# EAGLE design clock (EAGLE 9.5.2)
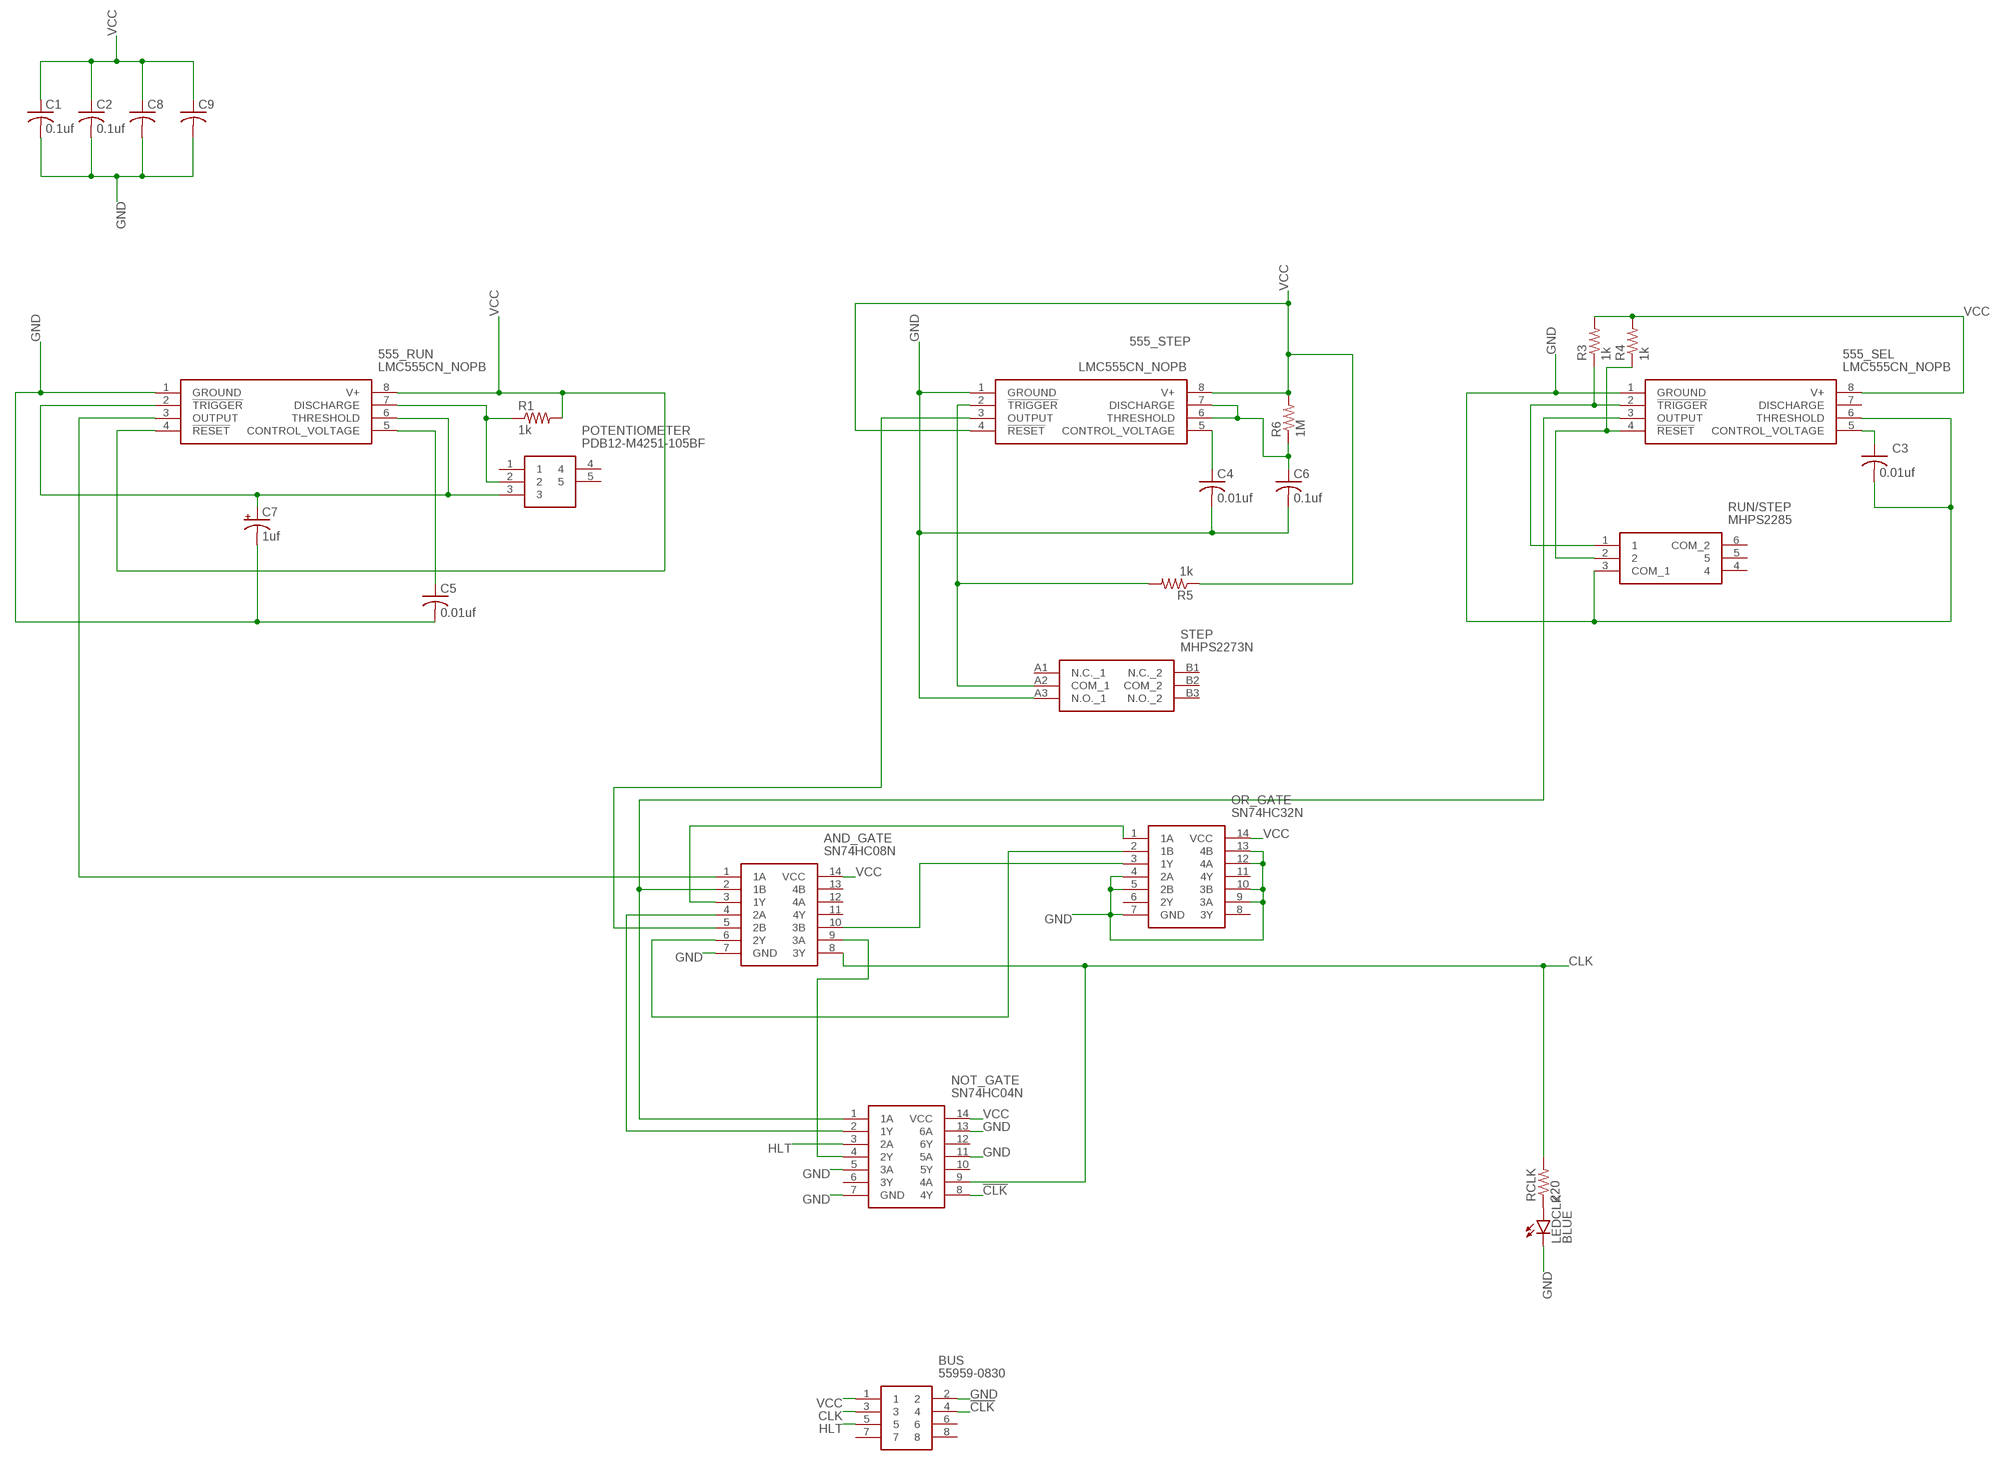
[diagram p0: schematic, sheet 1]

## Parts
555_RUN  LMC555CN_NOPB  [DIP794W53P254L959H508Q8N]
555_SEL  LMC555CN_NOPB  [DIP794W53P254L959H508Q8N]
555_STEP  LMC555CN_NOPB  [DIP794W53P254L959H508Q8N]
AND_GATE  SN74HC08N  [DIP794W53P254L1930H508Q14N]
BUS  55959-0830  [SHDR8W65P250X200_2X4_1140X1400]
C1  0.1uf  C-US025-024X044  [C025-024X044]
C2  0.1uf  C-US025-024X044  [C025-024X044]
C3  0.01uf  C-US025-024X044  [C025-024X044]
C4  0.01uf  C-US025-024X044  [C025-024X044]
C5  0.01uf  C-US025-024X044  [C025-024X044]
C6  0.1uf  C-US025-024X044  [C025-024X044]
C7  1uf  CPOL-USE5-5  [E5-5]
C8  C-US025-024X044  [C025-024X044]
C9  C-US025-024X044  [C025-024X044]
LEDCLK  BLUE  LED3MM  [LED3MM]
NOT_GATE  SN74HC04N  [DIP794W53P254L1930H508Q14N]
OR_GATE  SN74HC32N  [DIP794W53P254L1930H508Q14N]
POTENTIOMETER  PDB12-M4251-105BF  [PDB12M4251105BF]
R1  1k  R-US_0204/7  [0204/7]
R3  1k  R-US_0204/7  [0204/7]
R4  1k  R-US_0204/7  [0204/7]
R5  1k  R-US_0204/7  [0204/7]
R6  1M  R-US_0204/7  [0204/7]
RCLK  220  R-US_0204/7  [0204/7]
RUN/STEP  MHPS2285  [MHPS2285]
STEP  MHPS2273N  [MHPS2273N]

## Nets
!CLK: BUS.4 NOT_GATE.8(4Y)
CLK: AND_GATE.8(3Y) BUS.3 NOT_GATE.9(4A) RCLK.2
GND: 555_RUN.1(GROUND) 555_SEL.1(GROUND) 555_SEL.6(THRESHOLD) 555_STEP.1(GROUND) AND_GATE.7(GND) BUS.2 C1.2 C2.2 C3.2 C4.2 C5.2 C6.2 C7.- C8.2 C9.2 LEDCLK.K(C) NOT_GATE.5(3A) NOT_GATE.7(GND) NOT_GATE.11(5A) NOT_GATE.13(6A) OR_GATE.4(2A) OR_GATE.5(2B) OR_GATE.7(GND) OR_GATE.9(3A) OR_GATE.10(3B) OR_GATE.12(4A) OR_GATE.13(4B) RUN/STEP.3(COM_1) STEP.A3(N.O._1)
HLT: BUS.5 NOT_GATE.3(2A)
N$1: 555_RUN.7(DISCHARGE) POTENTIOMETER.2 R1.1
N$2: 555_RUN.5(CONTROL_VOLTAGE) C5.1
N$3: 555_RUN.3(OUTPUT) AND_GATE.1(1A)
N$4: 555_STEP.6(THRESHOLD) 555_STEP.7(DISCHARGE) C6.1 R6.1
N$5: 555_STEP.5(CONTROL_VOLTAGE) C4.1
N$6: 555_STEP.3(OUTPUT) AND_GATE.5(2B)
N$7: 555_STEP.2(!TRIGGER) R5.2 STEP.A2(COM_1)
N$8: 555_SEL.2(!TRIGGER) R3.1 RUN/STEP.1
N$9: 555_SEL.4(!RESET) R4.1 RUN/STEP.2
N$10: 555_SEL.3(OUTPUT) AND_GATE.2(1B) NOT_GATE.1(1A)
N$11: 555_SEL.5(CONTROL_VOLTAGE) C3.1
N$12: LEDCLK.A RCLK.1
N$17: AND_GATE.4(2A) NOT_GATE.2(1Y)
N$18: AND_GATE.3(1Y) OR_GATE.1(1A)
N$19: AND_GATE.9(3A) NOT_GATE.4(2Y)
N$20: AND_GATE.6(2Y) OR_GATE.2(1B)
N$21: AND_GATE.10(3B) OR_GATE.3(1Y)
POTENTIOMETER: 555_RUN.2(!TRIGGER) 555_RUN.6(THRESHOLD) C7.+ POTENTIOMETER.3
VCC: 555_RUN.4(!RESET) 555_RUN.8(V+) 555_SEL.8(V+) 555_STEP.4(!RESET) 555_STEP.8(V+) AND_GATE.14(VCC) BUS.1 C1.1 C2.1 C8.1 C9.1 NOT_GATE.14(VCC) OR_GATE.14(VCC) R1.2 R3.2 R4.2 R5.1 R6.2
Unconnected: 555_SEL.7(DISCHARGE) AND_GATE.11(4Y) AND_GATE.12(4A) AND_GATE.13(4B) BUS.6 BUS.7 BUS.8 NOT_GATE.6(3Y) NOT_GATE.10(5Y) NOT_GATE.12(6Y) OR_GATE.6(2Y) OR_GATE.8(3Y) OR_GATE.11(4Y) POTENTIOMETER.1 POTENTIOMETER.4 POTENTIOMETER.5 RUN/STEP.4 RUN/STEP.5 RUN/STEP.6(COM_2) STEP.A1(N.C._1) STEP.B1(N.C._2) STEP.B2(COM_2) STEP.B3(N.O._2)

## Library data of the parts
555_RUN 555_SEL 555_STEP = SamacSys_Parts:LMC555CN_NOPB: Worlds smallest 555 timer with low power, high accuracy and a Fmax of 3MHz Source: Datasheet <http://www.ti.com/lit/ml/mpdi001b/mpdi001b.pdf>; DESCRIPTION: Worlds smallest 555 timer with low power, high accuracy and a Fmax of 3MHz; HEIGHT: 5.08mm; MANUFACTURER_NAME: Texas Instruments; MANUFACTURER_PART_NUMBER: LMC555CN/NOPB; MOUSER_PART_NUMBER: 926-LMC555CN/NOPB; MOUSER_PRICE-STOCK: https://www.mouser.com/Search/Refine.aspx?Keyword=926-LMC555CN%2FNOPB
AND_GATE = SamacSys_Parts:SN74HC08N: QUADRUPLE 2-INPUT POSITIVE-NOR GATES Source: Datasheet <http://componentsearchengine.com/Datasheets/1/SN74HC08N.pdf>; DESCRIPTION: QUADRUPLE 2-INPUT POSITIVE-NOR GATES; HEIGHT: 5.08mm; MANUFACTURER_NAME: Texas Instruments; MANUFACTURER_PART_NUMBER: SN74HC08N; MOUSER_PART_NUMBER: 595-SN74HC08N; MOUSER_PRICE-STOCK: https://www.mouser.com/Search/Refine.aspx?Keyword=595-SN74HC08N
BUS = SamacSys_Parts:55959-0830: Headers & Wire Housings 8 Ckt R.A. Header Source: Datasheet <https://componentsearchengine.com/Datasheets/1/55959-0830.pdf>; DESCRIPTION: Headers & Wire Housings 8 Ckt R.A. Header; HEIGHT: 11.95mm; MANUFACTURER_NAME: Molex; MANUFACTURER_PART_NUMBER: 55959-0830; MOUSER_PART_NUMBER: 538-55959-0830; MOUSER_PRICE-STOCK: https://www.mouser.com/Search/Refine.aspx?Keyword=538-55959-0830
C1-C6 C8 C9 = rcl:C-US: CAPACITOR, American symbol; SPICEPREFIX: C
C7 = rcl:CPOL-US: POLARIZED CAPACITOR, American symbol; SPICEPREFIX: C
LEDCLK = led:LED: LED OSRAM: - CHIPLED LG R971, LG N971, LY N971, LG Q971, LY Q971, LO R971, LY R971 LH N974, LH R974 LS Q976, LO Q976, LY Q976 LO Q996 - Hyper CHIPLED LW Q18S LB Q993, LB Q99A, LB R99A - SideLED LS A670, LO A670, LY A670, LG A670, LP A670 LB A673, LV A673, LT A673, LW A673 LH A674 LY A675 LS A676, LA A676, LO A676, LY A676, LW A676 LS A679, LY A679, LG A679 - Hyper Micro SIDELED® LS Y876, LA Y876, LO Y876, LY Y876 LT Y87S - SmartLED LW L88C, LW L88S LB L89C, LB L89S, LG L890 LS L89K, LO L89K, LY L89K LS L896, LA L896, LO L896, LY L896 - TOPLED LS T670, LO T670, LY T670, LG T670, LP T670 LSG T670, LSP T670, LSY T670, LOP T670, LYG T670 LG T671, LOG T671, LSG T671 LB T673, LV T673, LT T673, LW T673 LH T674 LS T676, LA T676, LO T676, LY T676, LB T676, LH T676, LSB T676, LW T676 LB T67C, LV T67C, LT T67C, LS T67K, LO T67K, LY T67K, LW E67C LS E67B, LA E67B, LO E67B, LY E67B, LB E67C, LV E67C, LT E67C LW T67C LS T679, LY T679, LG T679 LS T770, LO T770, LY T770, LG T770, LP T770 LB T773, LV T773, LT T773, LW T773 LH T774 LS E675, LA E675, LY E675, LS T675 LS T776, LA T776, LO T776, LY T776, LB T776 LHGB T686 LT T68C, LB T68C - Hyper Mini TOPLED® LB M676 - Mini TOPLED Santana® LG M470 LS M47K, LO M47K, LY M47K Source: http://www.osram.convergy.de LUXEON: - LUMILED® LXK2-PW12-R00, LXK2-PW12-S00, LXK2-PW14-U00, LXK2-PW14-V00 LXK2-PM12-R00, LXK2-PM12-S00, LXK2-PM14-U00 LXK2-PE12-Q00, LXK2-PE12-R00, LXK2-PE12-S00, LXK2-PE14-T00, LXK2-PE14-U00 LXK2-PB12-K00, LXK2-PB12-L00, LXK2-PB12-M00, LXK2-PB14-N00, LXK2-PB14-P00, LXK2-PB14-Q00 LXK2-PR12-L00, LXK2-PR12-M00, LXK2-PR14-Q00, LXK2-PR14-R00 LXK2-PD12-Q00, LXK2-PD12-R00, LXK2-PD12-S00 LXK2-PH12-R00, LXK2-PH12-S00 LXK2-PL12-P00, LXK2-PL12-Q00, LXK2-PL12-R00 Source: www.luxeon.com KINGBRIGHT: KA-3528ASYC Source: www.kingbright.com
NOT_GATE = SamacSys_Parts:SN74HC04N: Hex inverter,SN74HC04N DIP14 2.6V 25pcs Source: Datasheet <http://www.ti.com/lit/gpn/sn74hc04>; DESCRIPTION: Hex inverter,SN74HC04N DIP14 2.6V 25pcs; HEIGHT: 5.08mm; MANUFACTURER_NAME: Texas Instruments; MANUFACTURER_PART_NUMBER: SN74HC04N; MOUSER_PART_NUMBER: 595-SN74HC04N; MOUSER_PRICE-STOCK: https://www.mouser.com/Search/Refine.aspx?Keyword=595-SN74HC04N
OR_GATE = SamacSys_Parts:SN74HC32N: QUADRUPLE 2-INPUT POSITIVE-OR GATES Source: Datasheet <http://www.ti.com/lit/gpn/sn74hc32>; DESCRIPTION: QUADRUPLE 2-INPUT POSITIVE-OR GATES; HEIGHT: 5.08mm; MANUFACTURER_NAME: Texas Instruments; MANUFACTURER_PART_NUMBER: SN74HC32N; MOUSER_PART_NUMBER: 595-SN74HC32N; MOUSER_PRICE-STOCK: https://www.mouser.com/Search/Refine.aspx?Keyword=595-SN74HC32N
POTENTIOMETER = SamacSys_Parts:PDB12-M4251-105BF: Potentiometers 1M LINEAR 12MM Source: Datasheet <https://componentsearchengine.com/Datasheets/1/PDB12-M4251-105BF.pdf>; DESCRIPTION: Potentiometers 1M LINEAR 12MM; HEIGHT: 15mm; MANUFACTURER_NAME: Bourns; MANUFACTURER_PART_NUMBER: PDB12-M4251-105BF; MOUSER_PART_NUMBER: 652-PDB12-M4251105BF; MOUSER_PRICE-STOCK: https://www.mouser.com/Search/Refine.aspx?Keyword=652-PDB12-M4251105BF
R1 R3-R6 RCLK = rcl:R-US_: RESISTOR, American symbol; SPICEPREFIX: R
RUN/STEP = SamacSys_Parts:MHPS2285: Pushbutton Switches 8mmDPDT PUSH PUSH Source: Datasheet <https://componentsearchengine.com/Datasheets/1/MHPS2285.pdf>; DESCRIPTION: Pushbutton Switches 8mmDPDT PUSH PUSH; HEIGHT: 13.5mm; MANUFACTURER_NAME: Apem; MANUFACTURER_PART_NUMBER: MHPS2285; MOUSER_PART_NUMBER: 642-MHPS2285; MOUSER_PRICE-STOCK: https://www.mouser.com/Search/Refine.aspx?Keyword=642-MHPS2285
STEP = SamacSys_Parts:MHPS2273N: Pushbutton Switches Momentary key DP Source: Datasheet <https://componentsearchengine.com/Datasheets/1/MHPS2273N.pdf>; DESCRIPTION: Pushbutton Switches Momentary key DP; HEIGHT: 13.5mm; MANUFACTURER_NAME: Apem; MANUFACTURER_PART_NUMBER: MHPS2273N; MOUSER_PART_NUMBER: 642-MHPS2273N; MOUSER_PRICE-STOCK: https://www.mouser.com/Search/Refine.aspx?Keyword=642-MHPS2273N

## Board
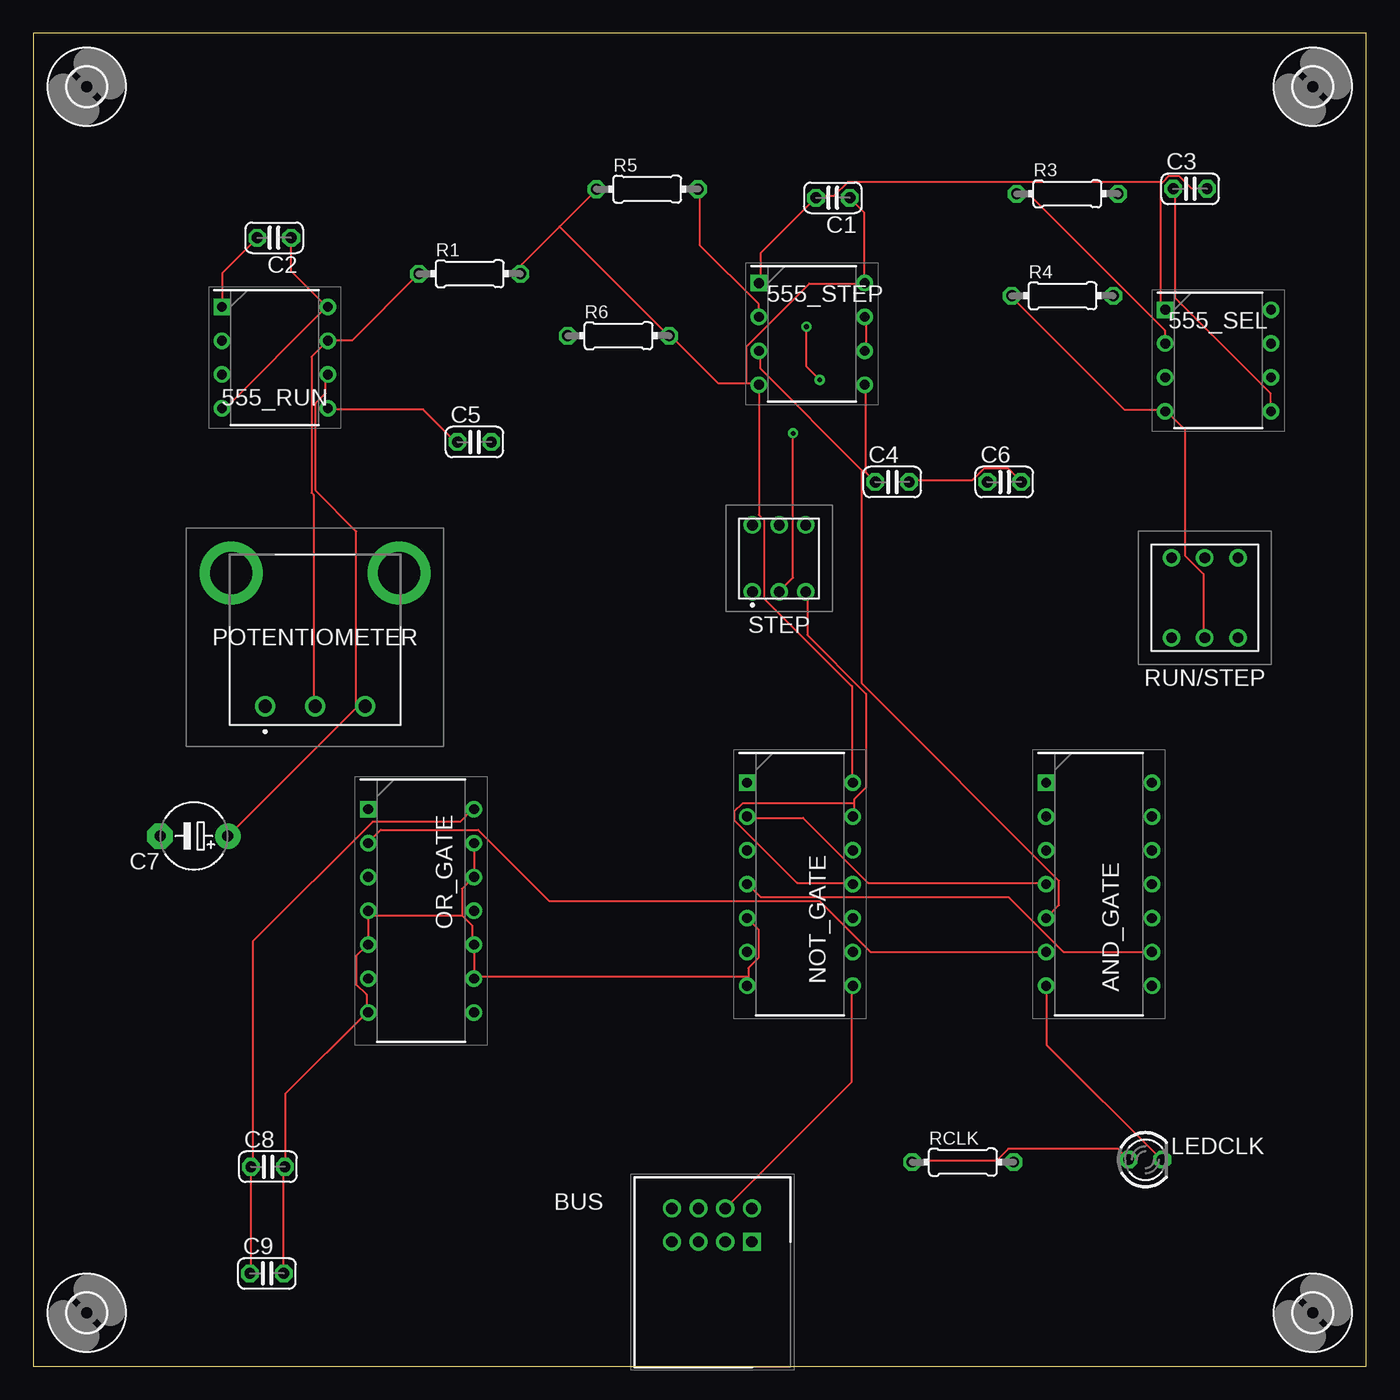
[diagram p1: board, top side]
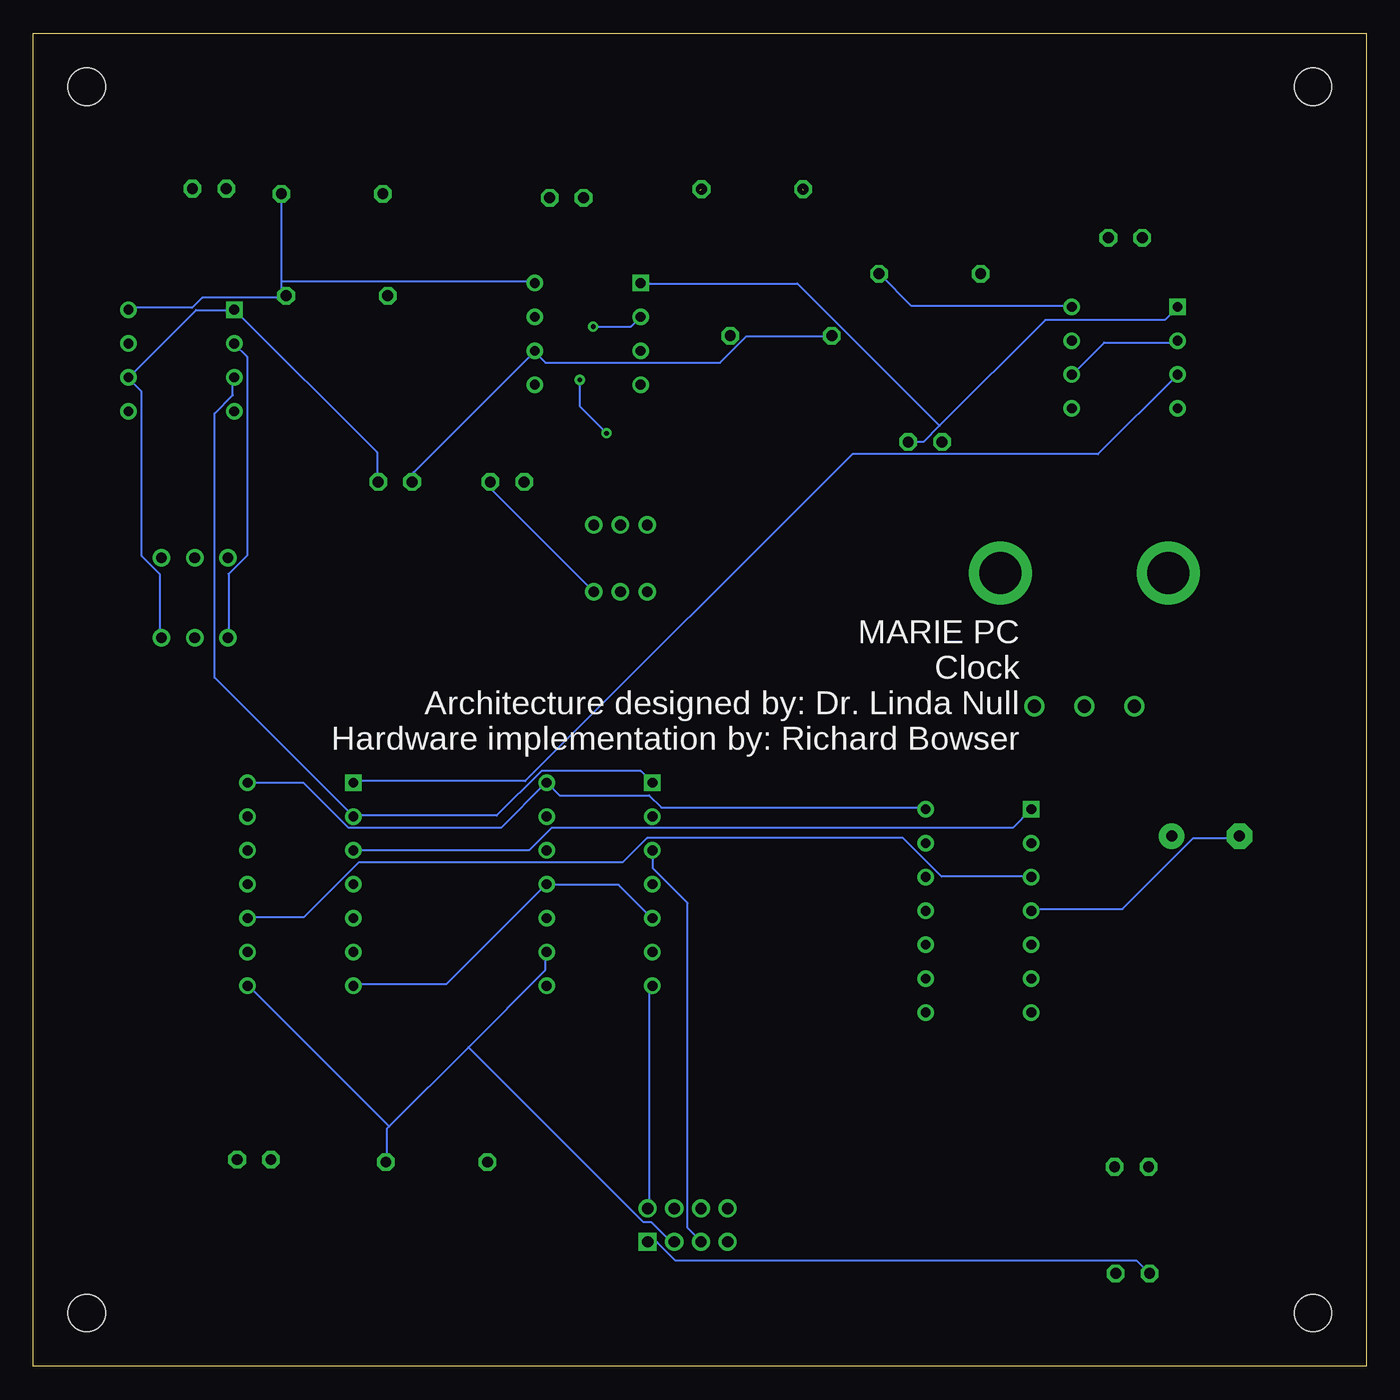
[diagram p2: board, bottom side, seen from below]

Size 100 x 100 mm. Coordinates in mm from the lower left corner, seen from the top.
Outline: 0,0 100,0 100,100 0,100 0,0
Copper layers (1*16): Top 0.035mm / dielectric 1.5mm / Bottom 0.035mm
Design rules "default": minimum track width 6mil, minimum drill 0.35mm, track to track 6mil, track to pad 6mil, pad to pad 6mil, via to via 6mil, smd to smd 6mil, copper to edge 40mil, drill to drill 6mil, minimum pad ring 10mil, minimum via ring 8mil, stop-mask expansion 4mil, vias tented up to drill 0mil, thermal gap 10mil

### Footprints (pad centres in the part's own frame; a part is rotated, then mirrored left to right if it is on the bottom)
DIP794W53P254L959H508Q8N = drill 0.73 pad 1.13 square: 1 -3.97,3.81 | drill 0.73 pad 1.13: 2 -3.97,1.27; 3 -3.97,-1.27; 4 -3.97,-3.81; 5 3.97,-3.81; 6 3.97,-1.27; 7 3.97,1.27; 8 3.97,3.81
DIP794W53P254L1930H508Q14N = drill 0.73 pad 1.13 square: 1 -3.97,7.62 | drill 0.73 pad 1.13: 2 -3.97,5.08; 3 -3.97,2.54; 4 -3.97,0; 5 -3.97,-2.54; 6 -3.97,-5.08; 7 -3.97,-7.62; 8 3.97,-7.62; 9 3.97,-5.08; 10 3.97,-2.54; 11 3.97,0; 12 3.97,2.54; 13 3.97,5.08; 14 3.97,7.62
SHDR8W65P250X200_2X4_1140X1400 = drill 0.85 pad 1.275 square: 1 0,0 | drill 0.85 pad 1.275: 2 0,-2.5; 3 2,0; 4 2,-2.5; 5 4,0; 6 4,-2.5; 7 6,0; 8 6,-2.5
C025-024X044 = drill 0.813 octagon: 1 -1.27,0; 2 1.27,0
E5-5 = drill 0.813 pad 1.905: + -2.54,0 | drill 0.813 pad 1.905 octagon: - 2.54,0
LED3MM = drill 0.813 octagon: A -1.27,0; K 1.27,0
PDB12M4251105BF = drill 1 pad 1.5: 1 -3.75,-4.7; 2 0,-4.7; 3 3.75,-4.7 | drill 3.139 pad 4.708: 4 -6.3,5.3; 5 6.3,5.3
0204/7 = drill 0.813 octagon: 1 -3.81,0; 2 3.81,0
MHPS2285 = drill 0.8 pad 1.3: 1 0,0; 2 2.5,0; 3 5,0; 4 5,6; 5 2.5,6; 6 0,6
MHPS2273N = drill 0.8 pad 1.3: A1 -2,-2.5; A2 0,-2.5; A3 2,-2.5; B1 -2,2.5; B2 0,2.5; B3 2,2.5
2,8 = hole 2.8: 0,0

### Placement (x,y rotation side)
555_RUN  18.12,75.67 0 top
555_SEL  88.9,75.45 0 top
555_STEP  58.41,77.45 0 top
AND_GATE  79.95,36.16 0 top
BUS  53.91,9.33 180 top
C1  59.99,87.66 180 top
C2  18.07,84.66 180 top
C3  86.79,88.34 0 top
C4  64.44,66.34 0 top
C5  33.09,69.34 0 top
C6  72.85,66.34 0 top
C7  12.05,39.77 180 top
C8  17.6,14.96 0 top
C9  17.52,6.96 0 top
LEDCLK  83.44,15.49 0 top
NOT_GATE  57.52,36.16 0 top
OR_GATE  29.09,34.16 0 top
POTENTIOMETER  21.14,54.21 0 top
R1  32.74,81.96 0 top
R3  77.58,87.96 0 top
R4  77.22,80.31 0 top
R5  46.06,88.31 0 top
R6  43.9,77.31 0 top
RCLK  69.74,15.31 0 top
RUN/STEP  85.39,54.64 0 top
STEP  55.95,60.61 0 top
U$1  [2,8]  4,4 0 top
U$2  [2,8]  4,96 0 top
U$3  [2,8]  96,96 0 top
U$4  [2,8]  96,4 0 top

### Tracks (layer width: path | path; a pad name or v marks a point on that pad's centre or on a via)
!CLK
  Top 0.152: NOT_GATE.8 61.42,28.5 61.42,21.34 51.97,11.89 BUS.4
CLK
  Bottom 0.152: 73.3,17.98 73.46,17.83 73.46,15.39 RCLK.2 | 73.3,17.98 67.36,23.93 | 67.36,23.93 61.57,29.72 61.57,30.94 NOT_GATE.9 | 73.3,17.98 83.82,28.5 AND_GATE.8 | 67.36,23.93 54.25,10.82 53.65,10.82 52.27,9.45 51.97,9.45 BUS.3
GND
  Top 0.152: AND_GATE.7 76.05,28.5 76.05,24.08 84.58,15.54 LEDCLK.K | 53.65,29.26 53.65,29.87 54.41,30.63 54.41,32.77 53.65,33.53 NOT_GATE.5 | 53.65,29.26 53.65,28.65 NOT_GATE.7 | 33.07,29.26 33.07,31.55 OR_GATE.10 32.92,31.7 32.92,33.07 32.16,33.83 | 33.07,29.26 33.07,29.11 OR_GATE.9 33.07,29.26 | OR_GATE.13 33.07,39.17 33.07,36.73 OR_GATE.12 32.92,36.58 32.16,35.81 32.16,33.83 | C9.2 18.75,7.01 18.75,14.94 C8.2 18.9,15.09 18.9,20.42 24.99,26.52 OR_GATE.7 24.99,26.67 24.99,27.89 24.23,28.65 24.23,30.79 24.99,31.55 OR_GATE.5 25.15,31.7 25.15,33.83 | 25.15,33.83 25.15,34.14 OR_GATE.4 25.15,33.83 | 25.15,33.83 32.16,33.83 | 33.07,29.26 53.65,29.26 | C4.2 65.84,66.45 70.41,66.45 71.32,67.36 73.15,67.36 74.07,66.45 C6.2 | 61.57,42.22 61.57,42.52 62.48,43.43 62.48,50.44 58.06,54.86 58.06,58.06 STEP.A3 | 61.57,42.22 61.57,41.3 NOT_GATE.13 | 555_RUN.1 14.17,79.55 14.17,81.99 16.76,84.58 C2.2 | 555_STEP.1 54.56,81.38 54.56,83.52 58.67,87.63 C1.2 58.83,87.78 60.05,87.78 61.11,88.85 84.73,88.85 | 84.73,88.85 84.58,88.7 84.58,79.7 84.89,79.4 555_SEL.1 | 84.73,88.85 85.19,89.31 85.95,89.31 86.87,88.39 87.94,88.39 C3.2 | 61.57,42.22 53.19,42.22 52.58,41.6 52.58,41 57.3,36.27 61.42,36.27 NOT_GATE.11
  Bottom 0.152: NOT_GATE.5 53.65,33.68 56.08,36.12 61.42,36.12 NOT_GATE.11 61.57,36.12 69.04,28.65 75.89,28.65 AND_GATE.7 | BUS.2 53.8,11.89 53.8,28.35 53.65,28.5 NOT_GATE.7 | C7.- 9.6,39.62 12.95,39.62 18.29,34.29 24.99,34.29 OR_GATE.4 | C4.2 65.68,66.29 65.68,65.84 58.06,58.22 STEP.A3 | 32,70.56 24.08,78.49 15.09,78.49 14.17,79.4 555_RUN.1 | 32,70.56 33.22,69.34 34.29,69.34 C5.2 | RUN/STEP.3 90.53,54.71 90.53,59.44 91.9,60.81 91.9,73.15 92.81,74.07 555_SEL.6 92.81,74.22 87.78,79.25 85.04,79.25 555_SEL.1 84.89,79.25 74.22,68.58 74.22,66.45 C6.2 | 32,70.56 42.67,81.23 54.41,81.23 555_STEP.1
HLT
  Bottom 0.152: NOT_GATE.3 53.49,38.56 53.49,37.34 50.9,34.75 50.9,10.36 49.99,9.45 BUS.5
N$1
  Top 0.152: R1.1 28.8,81.84 23.93,76.96 22.1,76.96 555_RUN.7 21.95,76.81 20.88,75.74 20.88,65.53 21.03,65.38 21.03,49.53 POTENTIOMETER.2
N$2
  Top 0.152: 555_RUN.5 22.1,71.78 29.26,71.78 31.7,69.34 C5.1
N$3
  Bottom 0.152: AND_GATE.1 75.89,43.89 63.09,43.89 38.56,68.43 20.12,68.43 14.17,74.37 555_RUN.3
N$4
  Top 0.152: 555_STEP.6 62.48,76.2 62.48,78.64 555_STEP.7
  Bottom 0.152: C6.1 71.48,66.45 71.48,67.06 62.48,76.05 555_STEP.6 62.33,76.05 61.57,75.29 48.46,75.29 46.48,77.27 40.23,77.27 R6.1
N$5
  Top 0.152: 555_STEP.5 62.48,73.61 62.48,67.06 63.09,66.45 C4.1
N$6
  Top 0.152: 555_STEP.3 54.56,76.05 54.56,74.83 62.18,67.21 62.18,51.21 76.96,36.42 76.96,34.59 76.05,33.68 AND_GATE.5
N$7  (via drill 0.35)  (1 unrouted)
  Top 0.152: 49.99,88.24 49.99,84.12 54.41,79.7 54.41,78.79 555_STEP.2 | STEP.A2 57,59.16 v57,70 | v59,74 58,75 v58,78
  Bottom 0.152: v57,70 59,72 v59,74 | v58,78 55.16,78 555_STEP.2
N$8
  Top 0.152: 555_SEL.2 84.89,76.81 84.89,77.72 74.68,87.94 73.91,87.94 R3.1
  Bottom 0.152: RUN/STEP.1 85.34,54.71 85.34,59.44 83.97,60.81 83.97,75.74 84.89,76.66 555_SEL.2
N$9
  Top 0.152: R4.1 73.46,80.16 81.84,71.78 84.89,71.78 555_SEL.4 85.04,71.63 86.41,70.26 86.41,60.81 87.78,59.44 87.78,54.71 RUN/STEP.2
N$10
  Bottom 0.152: NOT_GATE.1 53.65,43.89 54.41,44.65 61.87,44.65 65.23,41.3 75.89,41.3 AND_GATE.2 76.05,41.3 86.41,51.66 86.41,71.48 85.04,72.85 85.04,74.07 555_SEL.3
N$11
  Top 0.152: 555_SEL.5 92.81,71.78 92.81,73 85.65,80.16 85.65,88.24 C3.1
N$12
  Top 0.152: RCLK.1 65.99,15.39 72.24,15.39 73.15,16.31 81.38,16.31 82.14,15.54 LEDCLK.A
N$17
  Top 0.152: AND_GATE.4 75.89,36.27 62.64,36.27 57.76,41.15 53.65,41.15 NOT_GATE.2
N$18
  Bottom 0.152: AND_GATE.3 75.89,38.71 62.79,38.71 61.11,40.39 26.52,40.39 25.15,41.76 OR_GATE.1
N$19
  Top 0.152: AND_GATE.9 83.82,31.09 77.27,31.09 73.15,35.2 54.56,35.2 53.65,36.12 NOT_GATE.4
N$20
  Top 0.152: AND_GATE.6 75.89,31.09 62.79,31.09 58.98,34.9 38.71,34.9 33.38,40.23 26.06,40.23 25.15,39.32 OR_GATE.2
N$21
  Bottom 0.152: AND_GATE.10 83.82,33.68 79.7,33.68 75.59,37.8 55.78,37.8 53.95,39.62 34.75,39.62 31.85,36.73 25.15,36.73 OR_GATE.3
POTENTIOMETER
  Top 0.152: 24.23,49.38 24.84,49.38 POTENTIOMETER.3 24.23,49.38 | 24.23,49.38 14.63,39.78 C7.+ | 24.23,49.38 24.23,62.64 21.18,65.68 21.18,72.24 21.95,73 21.95,74.37 555_RUN.6
  Bottom 0.152: 555_RUN.2 14.17,76.81 19.66,76.81 21.95,74.52 555_RUN.6
VCC  (1 unrouted)
  Top 0.152: C9.1 16.31,7.01 16.31,14.94 C8.1 16.46,15.09 16.46,31.85 25.45,40.84 32,40.84 32.92,41.76 OR_GATE.14 | 555_RUN.4 14.17,71.93 14.48,71.93 21.95,79.4 555_RUN.8 21.95,79.55 19.36,82.14 19.36,84.58 C2.1 | 42.22,88.24 39.47,85.5 | 39.47,85.5 36.58,82.6 36.58,81.99 R1.2 | C1.1 61.27,87.63 62.33,86.56 62.33,81.38 555_STEP.8 62.33,81.23 58.22,81.23 53.49,76.5 53.49,73.76 | 53.49,73.76 51.36,73.76 47.85,77.27 R6.2 47.7,77.27 39.47,85.5 | 53.49,73.76 54.41,73.76 555_STEP.4 | 54.86,73.3 54.56,73.61 555_STEP.4 | 61.42,51.05 61.42,51 | 61.42,51 61.42,43.89 NOT_GATE.14 | 555_STEP.4 54.44,63.87 54.83,63.48 54.83,57.59 61.42,51
  Bottom 0.152: BUS.1 53.8,9.3 53.19,9.3 51.82,7.92 17.22,7.92 16.31,7.01 C9.1 | OR_GATE.14 33.07,41.91 52.88,41.91 53.8,42.82 60.5,42.82 61.42,43.74 NOT_GATE.14 61.57,43.74 64.92,40.39 76.35,40.39 79.7,43.74 83.82,43.74 AND_GATE.14 | 81.38,80.16 81.08,80.16 R4.2 81.38,80.16 | 81.38,80.16 87.33,80.16 88.09,79.4 92.81,79.4 555_SEL.8 | 81.38,80.16 81.38,81.38 | 81.38,81.38 81.38,87.94 R3.2 | 81.38,81.38 62.48,81.38 555_STEP.8 | 555_RUN.8 22.1,79.55 34.14,79.55 36.42,81.84 R1.2

### Text on the board
bNames: MARIE PC / Clock / Architecture designed by: Dr. Linda Null / Hardware implementation by: Richard Bowser